# EAGLE schematic 8Enc (EAGLE 6.5.0)

## Sheet 1 of 2
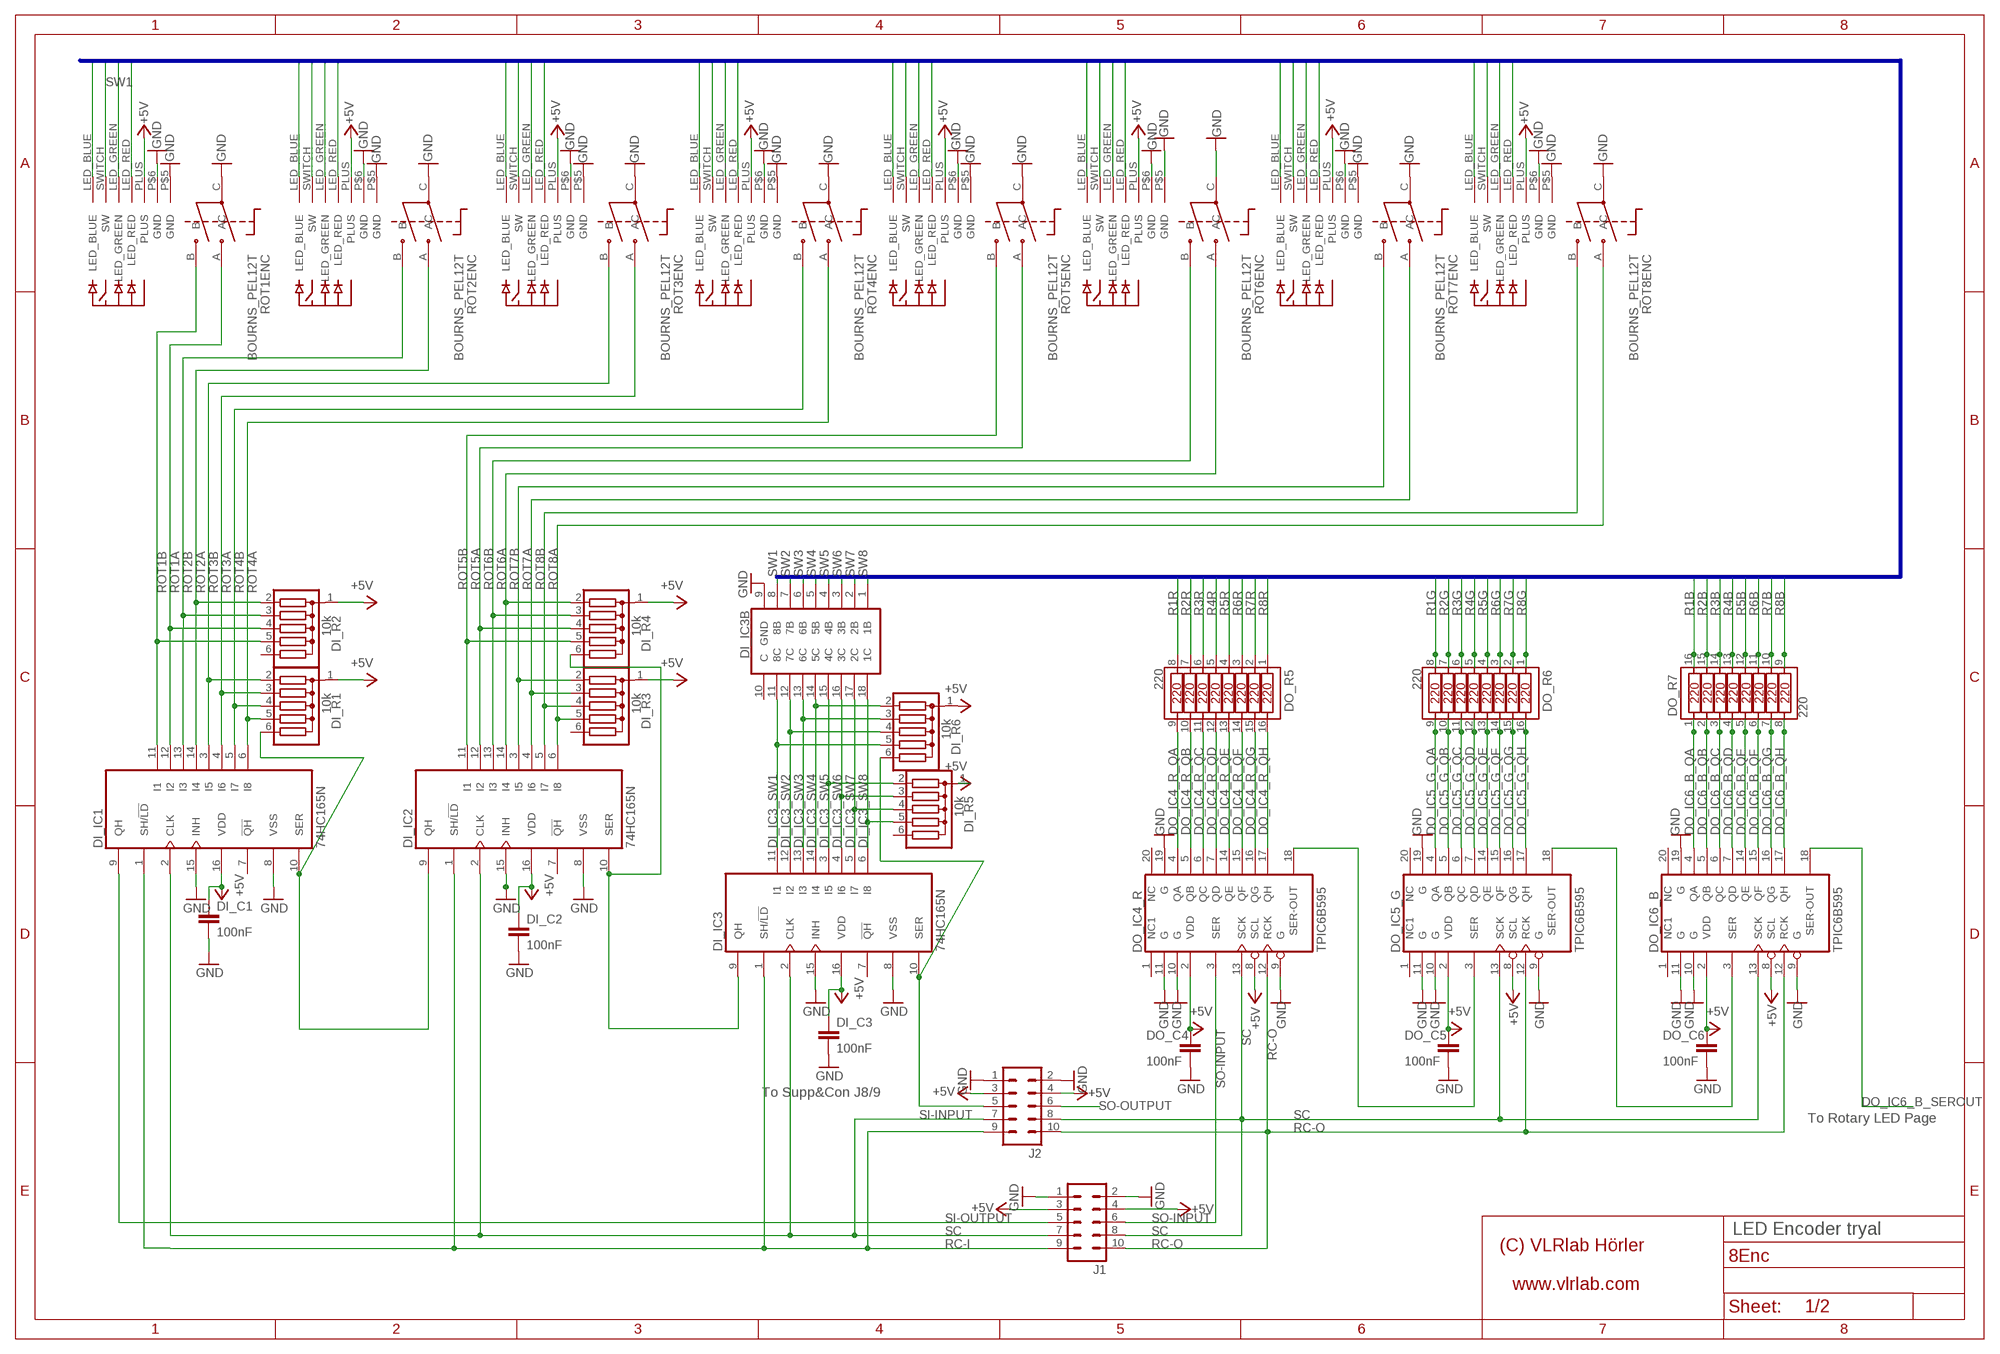
[diagram p0: schematic, sheet 1]

### Parts
DI_C1  100nF  C-EU025-024X044  [C025-024X044]
DI_C2  100nF  C-EU025-024X044  [C025-024X044]
DI_C3  100nF  C-EU025-024X044  [C025-024X044]
DI_IC1  74HC165N  74HC165NSO16D  [SO16D]
DI_IC2  74HC165N  74HC165NSO16D  [SO16D]
DI_IC3  74HC165N  74HC165NSO16D  [SO16D]
DI_IC3B  ULN2803SO18W  [SO18W]
DI_R1  10k  4306R  [SIL6]
DI_R2  10k  4306R  [SIL6]
DI_R3  10k  4306R  [SIL6]
DI_R4  10k  4306R  [SIL6]
DI_R5  10k  4306R  [SIL6]
DI_R6  10k  4306R  [SIL6]
DO_C4  100nF  C-EU025-024X044  [C025-024X044]
DO_C5  100nF  C-EU025-024X044  [C025-024X044]
DO_C6  100nF  C-EU025-024X044  [C025-024X044]
DO_IC4_R  TPIC6B595  TPIC6B595SO20W  [SO20W]
DO_IC5_G  TPIC6B595  TPIC6B595SO20W  [SO20W]
DO_IC6_B  TPIC6B595  TPIC6B595SO20W  [SO20W]
DO_R5  220  4816P-1SOIC16W  [SOIC16W]
DO_R6  220  4816P-1SOIC16W  [SOIC16W]
DO_R7  220  4816P-1SOIC16W  [SOIC16W]
J1  ML10  [ML10]
J2  ML10  [ML10]
ROT1  BOURNS_PEL12T  BOURNS_PEL12T_11-LED-RING  [PEL12T_11-LED-RING]
ROT2  BOURNS_PEL12T  BOURNS_PEL12T_11-LED-RING  [PEL12T_11-LED-RING]
ROT3  BOURNS_PEL12T  BOURNS_PEL12T_11-LED-RING  [PEL12T_11-LED-RING]
ROT4  BOURNS_PEL12T  BOURNS_PEL12T_11-LED-RING  [PEL12T_11-LED-RING]
ROT5  BOURNS_PEL12T  BOURNS_PEL12T_11-LED-RING  [PEL12T_11-LED-RING]
ROT6  BOURNS_PEL12T  BOURNS_PEL12T_11-LED-RING  [PEL12T_11-LED-RING]
ROT7  BOURNS_PEL12T  BOURNS_PEL12T_11-LED-RING  [PEL12T_11-LED-RING]
ROT8  BOURNS_PEL12T  BOURNS_PEL12T_11-LED-RING  [PEL12T_11-LED-RING]

### Nets
+5V [VDD]: DI_C1.1 DI_C2.1 DI_C3.1 DI_IC1.16(VDD) DI_IC2.16(VDD) DI_IC3.16(VDD) DI_R1.1 DI_R2.1 DI_R3.1 DI_R4.1 DI_R5.1 DI_R6.1 DO_C4.1 DO_C5.1 DO_C6.1 DO_IC4_R.2(VDD) DO_IC4_R.8(SCL) DO_IC5_G.2(VDD) DO_IC5_G.8(SCL) DO_IC6_B.2(VDD) DO_IC6_B.8(SCL) J1.3 J1.4 J2.3 J2.4 ROT1.PLUS(ENC:PLUS) ROT2.PLUS(ENC:PLUS) ROT3.PLUS(ENC:PLUS) ROT4.PLUS(ENC:PLUS) ROT5.PLUS(ENC:PLUS) ROT6.PLUS(ENC:PLUS) ROT7.PLUS(ENC:PLUS) ROT8.PLUS(ENC:PLUS) ; also sheet 2
DI_IC3_SW1: DI_IC3.11(I1) DI_IC3B.11(8C) DI_R6.5
DI_IC3_SW2: DI_IC3.12(I2) DI_IC3B.12(7C) DI_R6.4
DI_IC3_SW3: DI_IC3.13(I3) DI_IC3B.13(6C) DI_R6.3
DI_IC3_SW4: DI_IC3.14(I4) DI_IC3B.14(5C) DI_R6.2
DI_IC3_SW5: DI_IC3.3(I5) DI_IC3B.15(4C) DI_R5.2
DI_IC3_SW6: DI_IC3.4(I6) DI_IC3B.16(3C) DI_R5.3
DI_IC3_SW7: DI_IC3.5(I7) DI_IC3B.17(2C) DI_R5.4
DI_IC3_SW8: DI_IC3.6(I8) DI_IC3B.18(1C) DI_R5.5
DI_IC4_SER_OUT2: DI_IC1.10(SER) DI_IC2.9(QH) DI_R1.6
DI_IC5_SER_OUT2: DI_IC2.10(SER) DI_IC3.9(QH) DI_R4.6
DO_IC4_R_QA: DO_IC4_R.4(QA) DO_R5.9
DO_IC4_R_QB: DO_IC4_R.5(QB) DO_R5.10
DO_IC4_R_QC: DO_IC4_R.6(QC) DO_R5.11
DO_IC4_R_QD: DO_IC4_R.7(QD) DO_R5.12
DO_IC4_R_QE: DO_IC4_R.14(QE) DO_R5.13
DO_IC4_R_QF: DO_IC4_R.15(QF) DO_R5.14
DO_IC4_R_QG: DO_IC4_R.16(QG) DO_R5.15
DO_IC4_R_QH: DO_IC4_R.17(QH) DO_R5.16
DO_IC4_R_SEROUT: DO_IC4_R.18(SER-OUT) DO_IC5_G.3(SER)
DO_IC5_G_QA: DO_IC5_G.4(QA) DO_R6.9
DO_IC5_G_QB: DO_IC5_G.5(QB) DO_R6.10
DO_IC5_G_QC: DO_IC5_G.6(QC) DO_R6.11
DO_IC5_G_QD: DO_IC5_G.7(QD) DO_R6.12
DO_IC5_G_QE: DO_IC5_G.14(QE) DO_R6.13
DO_IC5_G_QF: DO_IC5_G.15(QF) DO_R6.14
DO_IC5_G_QG: DO_IC5_G.16(QG) DO_R6.15
DO_IC5_G_QH: DO_IC5_G.17(QH) DO_R6.16
DO_IC5_G_SEROUT: DO_IC5_G.18(SER-OUT) DO_IC6_B.3(SER)
DO_IC6_B_QA: DO_IC6_B.4(QA) DO_R7.1
DO_IC6_B_QB: DO_IC6_B.5(QB) DO_R7.2
DO_IC6_B_QC: DO_IC6_B.6(QC) DO_R7.3
DO_IC6_B_QD: DO_IC6_B.7(QD) DO_R7.4
DO_IC6_B_QE: DO_IC6_B.14(QE) DO_R7.5
DO_IC6_B_QF: DO_IC6_B.15(QF) DO_R7.6
DO_IC6_B_QG: DO_IC6_B.16(QG) DO_R7.7
DO_IC6_B_QH: DO_IC6_B.17(QH) DO_R7.8
DO_IC6_B_SEROUT: DO_IC6_B.18(SER-OUT) ; also sheet 2
GND: DI_C1.2 DI_C2.2 DI_C3.2 DI_IC1.8(VSS) DI_IC1.15(INH) DI_IC2.8(VSS) DI_IC2.15(INH) DI_IC3.8(VSS) DI_IC3.15(INH) DI_IC3B.9(GND) DO_C4.2 DO_C5.2 DO_C6.2 DO_IC4_R.9(G) DO_IC4_R.10(G) DO_IC4_R.11(G) DO_IC4_R.19(G) DO_IC5_G.9(G) DO_IC5_G.10(G) DO_IC5_G.11(G) DO_IC5_G.19(G) DO_IC6_B.9(G) DO_IC6_B.10(G) DO_IC6_B.11(G) DO_IC6_B.19(G) J1.1 J1.2 J2.1 J2.2 ROT1.C(ENC:C) ROT1.P$5(ENC:GND) ROT1.P$6(ENC:GND) ROT2.C(ENC:C) ROT2.P$5(ENC:GND) ROT2.P$6(ENC:GND) ROT3.C(ENC:C) ROT3.P$5(ENC:GND) ROT3.P$6(ENC:GND) ROT4.C(ENC:C) ROT4.P$5(ENC:GND) ROT4.P$6(ENC:GND) ROT5.C(ENC:C) ROT5.P$5(ENC:GND) ROT5.P$6(ENC:GND) ROT6.C(ENC:C) ROT6.P$5(ENC:GND) ROT6.P$6(ENC:GND) ROT7.C(ENC:C) ROT7.P$5(ENC:GND) ROT7.P$6(ENC:GND) ROT8.C(ENC:C) ROT8.P$5(ENC:GND) ROT8.P$6(ENC:GND) ; also sheet 2
R1B: DO_R7.16 ROT1.LED_BLUE(ENC:LED_BLUE)
R1G: DO_R6.8 ROT1.LED_GREEN(ENC:LED_GREEN)
R1R: DO_R5.8 ROT1.LED_RED(ENC:LED_RED)
R2B: DO_R7.15 ROT2.LED_BLUE(ENC:LED_BLUE)
R2G: DO_R6.7 ROT2.LED_GREEN(ENC:LED_GREEN)
R2R: DO_R5.7 ROT2.LED_RED(ENC:LED_RED)
R3B: DO_R7.14 ROT3.LED_BLUE(ENC:LED_BLUE)
R3G: DO_R6.6 ROT3.LED_GREEN(ENC:LED_GREEN)
R3R: DO_R5.6 ROT3.LED_RED(ENC:LED_RED)
R4B: DO_R7.13 ROT4.LED_BLUE(ENC:LED_BLUE)
R4G: DO_R6.5 ROT4.LED_GREEN(ENC:LED_GREEN)
R4R: DO_R5.5 ROT4.LED_RED(ENC:LED_RED)
R5B: DO_R7.12 ROT5.LED_BLUE(ENC:LED_BLUE)
R5G: DO_R6.4 ROT5.LED_GREEN(ENC:LED_GREEN)
R5R: DO_R5.4 ROT5.LED_RED(ENC:LED_RED)
R6B: DO_R7.11 ROT6.LED_BLUE(ENC:LED_BLUE)
R6G: DO_R6.3 ROT6.LED_GREEN(ENC:LED_GREEN)
R6R: DO_R5.3 ROT6.LED_RED(ENC:LED_RED)
R7B: DO_R7.10 ROT7.LED_BLUE(ENC:LED_BLUE)
R7G: DO_R6.2 ROT7.LED_GREEN(ENC:LED_GREEN)
R7R: DO_R5.2 ROT7.LED_RED(ENC:LED_RED)
R8B: DO_R7.9 ROT8.LED_BLUE(ENC:LED_BLUE)
R8G: DO_R6.1 ROT8.LED_GREEN(ENC:LED_GREEN)
R8R: DO_R5.1 ROT8.LED_RED(ENC:LED_RED)
RC-I: DI_IC1.1(SH/!LD) DI_IC2.1(SH/!LD) DI_IC3.1(SH/!LD) J1.9 J2.9
RC-O: DO_IC4_R.12(RCK) DO_IC5_G.12(RCK) DO_IC6_B.12(RCK) J1.10 J2.10 ; also sheet 2
ROT1A: DI_IC1.12(I2) DI_R2.4 ROT1.A(ENC:A)
ROT1B: DI_IC1.11(I1) DI_R2.5 ROT1.B(ENC:B)
ROT2A: DI_IC1.14(I4) DI_R2.2 ROT2.A(ENC:A)
ROT2B: DI_IC1.13(I3) DI_R2.3 ROT2.B(ENC:B)
ROT3A: DI_IC1.4(I6) DI_R1.3 ROT3.A(ENC:A)
ROT3B: DI_IC1.3(I5) DI_R1.2 ROT3.B(ENC:B)
ROT4A: DI_IC1.6(I8) DI_R1.5 ROT4.A(ENC:A)
ROT4B: DI_IC1.5(I7) DI_R1.4 ROT4.B(ENC:B)
ROT5A: DI_IC2.12(I2) DI_R4.4 ROT5.A(ENC:A)
ROT5B: DI_IC2.11(I1) DI_R4.5 ROT5.B(ENC:B)
ROT6A: DI_IC2.14(I4) DI_R4.2 ROT6.A(ENC:A)
ROT6B: DI_IC2.13(I3) DI_R4.3 ROT6.B(ENC:B)
ROT7A: DI_IC2.4(I6) DI_R3.3 ROT7.A(ENC:A)
ROT7B: DI_IC2.3(I5) DI_R3.2 ROT7.B(ENC:B)
ROT8A: DI_IC2.6(I8) DI_R3.5 ROT8.A(ENC:A)
ROT8B: DI_IC2.5(I7) DI_R3.4 ROT8.B(ENC:B)
SC: DI_IC1.2(CLK) DI_IC2.2(CLK) DI_IC3.2(CLK) DO_IC4_R.13(SCK) DO_IC5_G.13(SCK) DO_IC6_B.13(SCK) J1.7 J1.8 J2.7 J2.8 ; also sheet 2
SI-INPUT: DI_IC3.10(SER) DI_R6.6 J2.5
SI-OUTPUT: DI_IC1.9(QH) J1.5
SO-INPUT: DO_IC4_R.3(SER) J1.6
SO-OUTPUT: J2.6 ; also sheet 2
SW1: DI_IC3B.8(8B) ROT1.SWITCH(ENC:SW)
SW2: DI_IC3B.7(7B) ROT2.SWITCH(ENC:SW)
SW3: DI_IC3B.6(6B) ROT3.SWITCH(ENC:SW)
SW4: DI_IC3B.5(5B) ROT4.SWITCH(ENC:SW)
SW5: DI_IC3B.4(4B) ROT5.SWITCH(ENC:SW)
SW6: DI_IC3B.3(3B) ROT6.SWITCH(ENC:SW)
SW7: DI_IC3B.2(2B) ROT7.SWITCH(ENC:SW)
SW8: DI_IC3B.1(1B) ROT8.SWITCH(ENC:SW)
Unconnected: DI_IC1.7(!QH) DI_IC2.7(!QH) DI_IC3.7(!QH) DI_IC3B.10(C) DI_R2.6 DI_R3.6 DI_R5.6 DO_IC4_R.1(NC1) DO_IC4_R.20(NC) DO_IC5_G.1(NC1) DO_IC5_G.20(NC) DO_IC6_B.1(NC1) DO_IC6_B.20(NC)

### Buses
SW1,SW2,SW3,SW4,SW5,SW6,SW7,SW8,R1B,R2B,R3B,R4B,R5B,R6B,R7B,R8B,R1G,R2G,R3G,R4G,R5G,R6G,R7G,R8G,R1R,R2R,R3R,R4R,R5R,R6R,R7R,R8R

### Notes on the sheet
- To Supp&Con J8/9
- To Rotary LED Page
- LED Encoder tryal

## Sheet 2 of 2
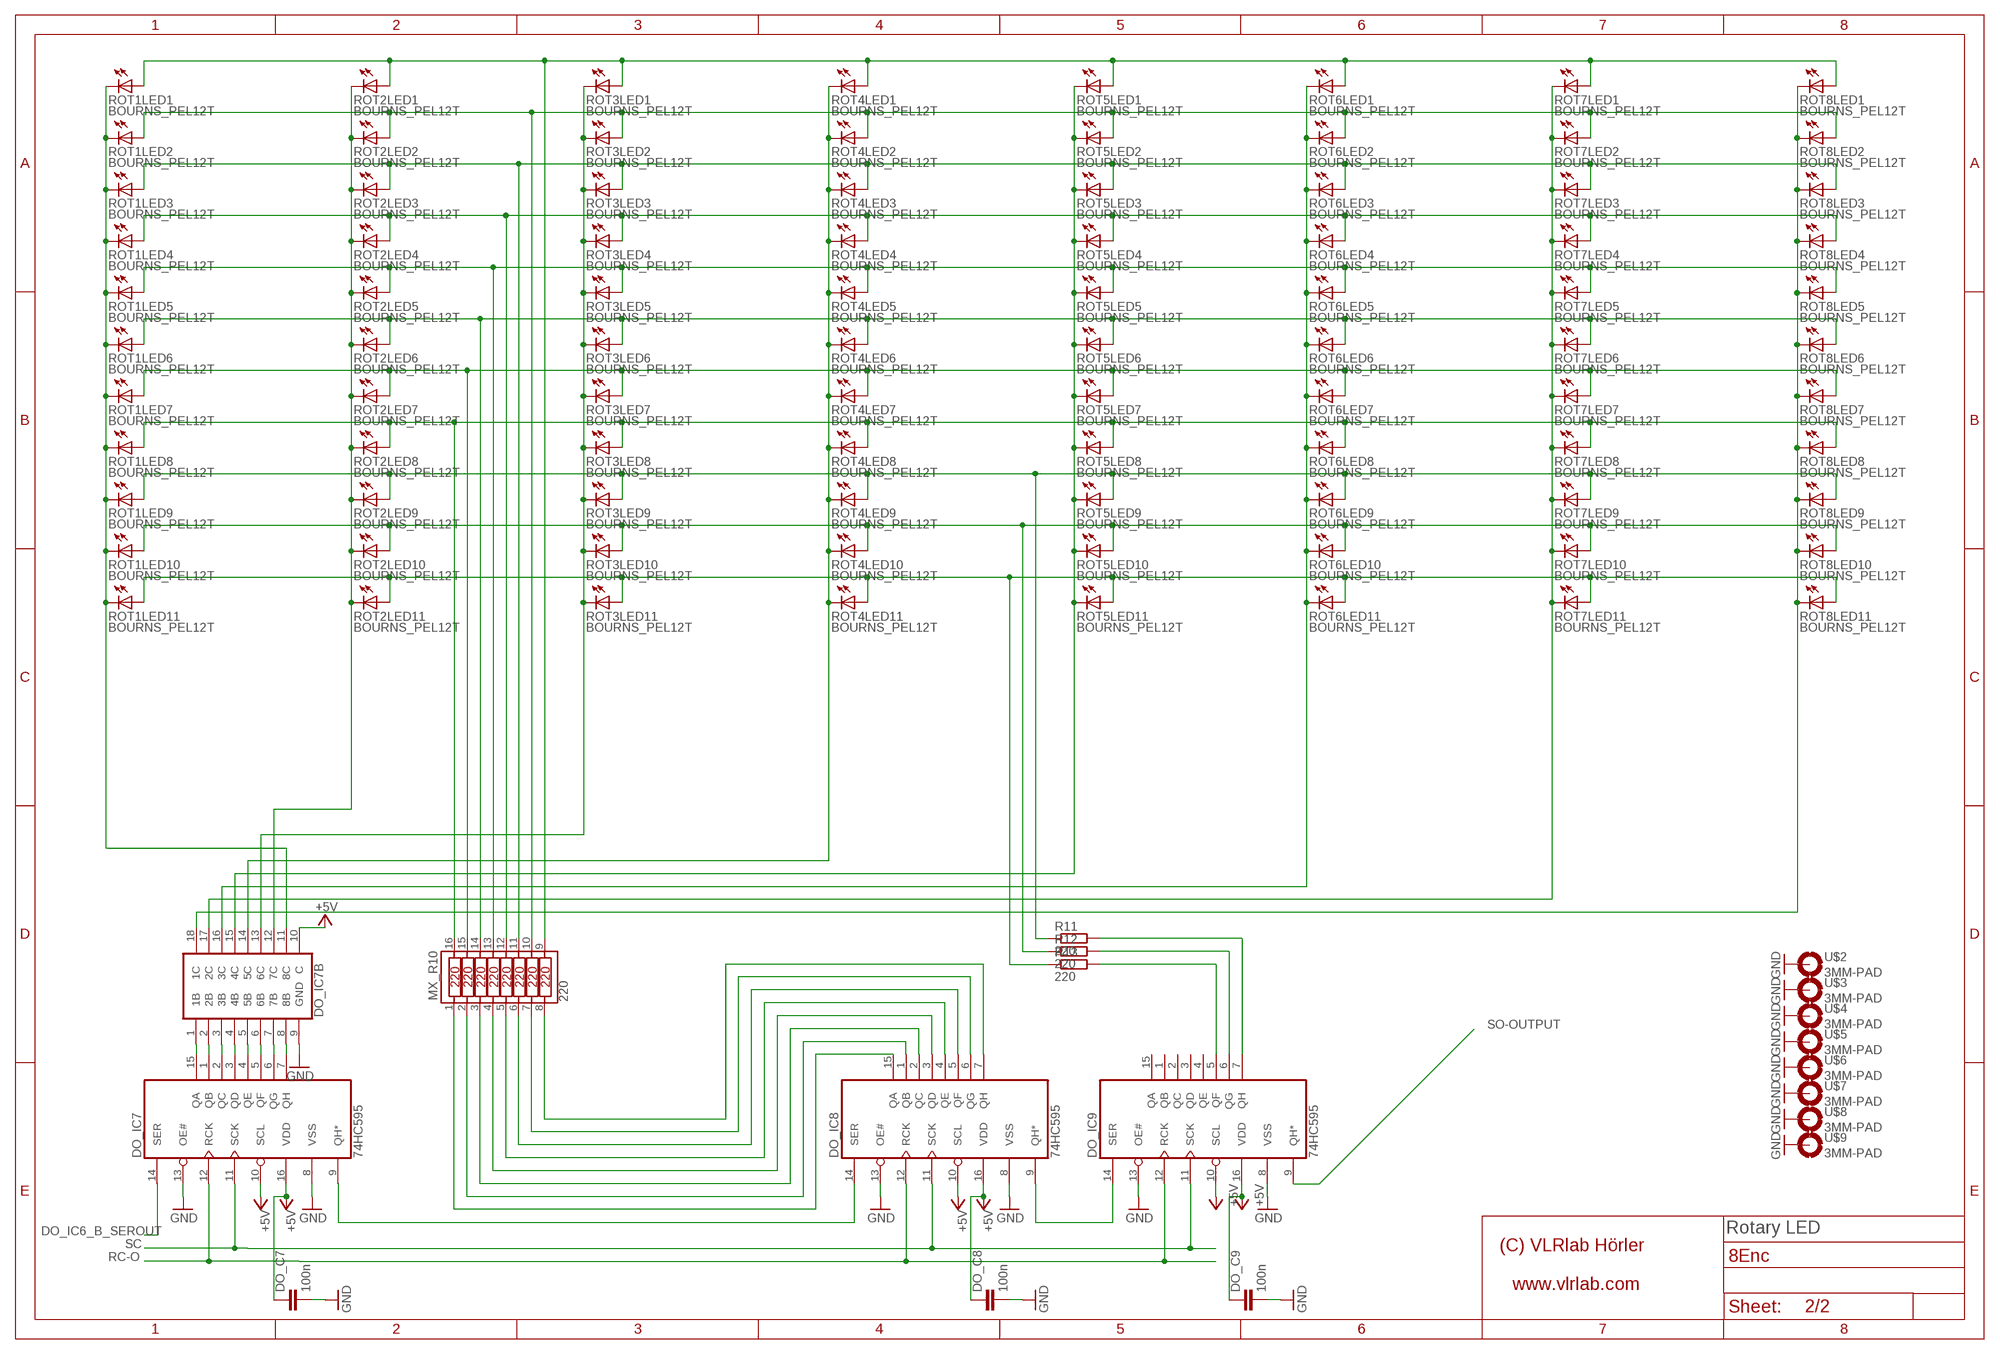
[diagram p1: schematic, sheet 2]

### Parts
DO_C7  100n  C-EU025-024X044  [C025-024X044]
DO_C8  100n  C-EU025-024X044  [C025-024X044]
DO_C9  100n  C-EU025-024X044  [C025-024X044]
DO_IC7  74HC595  74HC595SO16D  [SO16D]
DO_IC7B  ULN2803SO18W  [SO18W]
DO_IC8  74HC595  74HC595SO16D  [SO16D]
DO_IC9  74HC595  74HC595SO16D  [SO16D]
MX_R10  220  4816P-1SOIC16W  [SOIC16W]
R11  220  R-EU_0204/7  [0204/7]
R12  220  R-EU_0204/7  [0204/7]
R13  220  R-EU_0204/7  [0204/7]
U$2  3MM-PAD  [3MM-PAD]
U$3  3MM-PAD  [3MM-PAD]
U$4  3MM-PAD  [3MM-PAD]
U$5  3MM-PAD  [3MM-PAD]
U$6  3MM-PAD  [3MM-PAD]
U$7  3MM-PAD  [3MM-PAD]
U$8  3MM-PAD  [3MM-PAD]
U$9  3MM-PAD  [3MM-PAD]

### Nets
+5V [VDD]: DO_C7.1 DO_C8.1 DO_C9.1 DO_IC7.10(SCL) DO_IC7.16(VDD) DO_IC7B.10(C) DO_IC8.10(SCL) DO_IC8.16(VDD) DO_IC9.10(SCL) DO_IC9.16(VDD) ; also sheet 1
DO_IC6_B_SEROUT: DO_IC7.14(SER) ; also sheet 1
DO_IC7_QA: DO_IC7.15(QA) DO_IC7B.1(1B)
DO_IC7_QB: DO_IC7.1(QB) DO_IC7B.2(2B)
DO_IC7_QC: DO_IC7.2(QC) DO_IC7B.3(3B)
DO_IC7_QD: DO_IC7.3(QD) DO_IC7B.4(4B)
DO_IC7_QE: DO_IC7.4(QE) DO_IC7B.5(5B)
DO_IC7_QF: DO_IC7.5(QF) DO_IC7B.6(6B)
DO_IC7_QG: DO_IC7.6(QG) DO_IC7B.7(7B)
DO_IC7_QH: DO_IC7.7(QH) DO_IC7B.8(8B)
DO_IC7_SEROUT: DO_IC7.9(QH*) DO_IC8.14(SER)
DO_IC8_QA: DO_IC8.15(QA) MX_R10.1
DO_IC8_QB: DO_IC8.1(QB) MX_R10.2
DO_IC8_QC: DO_IC8.2(QC) MX_R10.3
DO_IC8_QD: DO_IC8.3(QD) MX_R10.4
DO_IC8_QE: DO_IC8.4(QE) MX_R10.5
DO_IC8_QF: DO_IC8.5(QF) MX_R10.6
DO_IC8_QG: DO_IC8.6(QG) MX_R10.7
DO_IC8_QH: DO_IC8.7(QH) MX_R10.8
DO_IC8_SEROUT: DO_IC8.9(QH*) DO_IC9.14(SER)
DO_IC9_QF: DO_IC9.5(QF) R13.2
DO_IC9_QG: DO_IC9.6(QG) R12.2
DO_IC9_QH: DO_IC9.7(QH) R11.2
GND: DO_C7.2 DO_C8.2 DO_C9.2 DO_IC7.8(VSS) DO_IC7.13(OE#) DO_IC7B.9(GND) DO_IC8.8(VSS) DO_IC8.13(OE#) DO_IC9.8(VSS) DO_IC9.13(OE#) U$2.B3(MOUNT) U$3.B3(MOUNT) U$4.B3(MOUNT) U$5.B3(MOUNT) U$6.B3(MOUNT) U$7.B3(MOUNT) U$8.B3(MOUNT) U$9.B3(MOUNT) ; also sheet 1
MATRIXLED1: MX_R10.9 ROT1.A1(LED1:A) ROT2.A1(LED1:A) ROT3.A1(LED1:A) ROT4.A1(LED1:A) ROT5.A1(LED1:A) ROT6.A1(LED1:A) ROT7.A1(LED1:A) ROT8.A1(LED1:A)
MATRIXLED2: MX_R10.10 ROT1.A2(LED2:A) ROT2.A2(LED2:A) ROT3.A2(LED2:A) ROT4.A2(LED2:A) ROT5.A2(LED2:A) ROT6.A2(LED2:A) ROT7.A2(LED2:A) ROT8.A2(LED2:A)
MATRIXLED3: MX_R10.11 ROT1.A3(LED3:A) ROT2.A3(LED3:A) ROT3.A3(LED3:A) ROT4.A3(LED3:A) ROT5.A3(LED3:A) ROT6.A3(LED3:A) ROT7.A3(LED3:A) ROT8.A3(LED3:A)
MATRIXLED4: MX_R10.12 ROT1.A4(LED4:A) ROT2.A4(LED4:A) ROT3.A4(LED4:A) ROT4.A4(LED4:A) ROT5.A4(LED4:A) ROT6.A4(LED4:A) ROT7.A4(LED4:A) ROT8.A4(LED4:A)
MATRIXLED5: MX_R10.13 ROT1.A5(LED5:A) ROT2.A5(LED5:A) ROT3.A5(LED5:A) ROT4.A5(LED5:A) ROT5.A5(LED5:A) ROT6.A5(LED5:A) ROT7.A5(LED5:A) ROT8.A5(LED5:A)
MATRIXLED6: MX_R10.14 ROT1.A6(LED6:A) ROT2.A6(LED6:A) ROT3.A6(LED6:A) ROT4.A6(LED6:A) ROT5.A6(LED6:A) ROT6.A6(LED6:A) ROT7.A6(LED6:A) ROT8.A6(LED6:A)
MATRIXLED7: MX_R10.15 ROT1.A7(LED7:A) ROT2.A7(LED7:A) ROT3.A7(LED7:A) ROT4.A7(LED7:A) ROT5.A7(LED7:A) ROT6.A7(LED7:A) ROT7.A7(LED7:A) ROT8.A7(LED7:A)
MATRIXLED8: MX_R10.16 ROT1.A8(LED8:A) ROT2.A8(LED8:A) ROT3.A8(LED8:A) ROT4.A8(LED8:A) ROT5.A8(LED8:A) ROT6.A8(LED8:A) ROT7.A8(LED8:A) ROT8.A8(LED8:A)
MATRIXLED9: R11.1 ROT1.A9(LED9:A) ROT2.A9(LED9:A) ROT3.A9(LED9:A) ROT4.A9(LED9:A) ROT5.A9(LED9:A) ROT6.A9(LED9:A) ROT7.A9(LED9:A) ROT8.A9(LED9:A)
MATRIXLED10: R12.1 ROT1.A10(LED10:A) ROT2.A10(LED10:A) ROT3.A10(LED10:A) ROT4.A10(LED10:A) ROT5.A10(LED10:A) ROT6.A10(LED10:A) ROT7.A10(LED10:A) ROT8.A10(LED10:A)
MATRIXLED11: R13.1 ROT1.A12(LED11:A) ROT2.A12(LED11:A) ROT3.A12(LED11:A) ROT4.A12(LED11:A) ROT5.A12(LED11:A) ROT6.A12(LED11:A) ROT7.A12(LED11:A) ROT8.A12(LED11:A)
MATRIXROT1: DO_IC7B.11(8C) ROT1.K1(LED1:C) ROT1.K2(LED2:C) ROT1.K3(LED3:C) ROT1.K4(LED4:C) ROT1.K5(LED5:C) ROT1.K6(LED6:C) ROT1.K7(LED7:C) ROT1.K8(LED8:C) ROT1.K9(LED9:C) ROT1.K10(LED10:C) ROT1.K12(LED11:C)
MATRIXROT2: DO_IC7B.12(7C) ROT2.K1(LED1:C) ROT2.K2(LED2:C) ROT2.K3(LED3:C) ROT2.K4(LED4:C) ROT2.K5(LED5:C) ROT2.K6(LED6:C) ROT2.K7(LED7:C) ROT2.K8(LED8:C) ROT2.K9(LED9:C) ROT2.K10(LED10:C) ROT2.K12(LED11:C)
MATRIXROT3: DO_IC7B.13(6C) ROT3.K1(LED1:C) ROT3.K2(LED2:C) ROT3.K3(LED3:C) ROT3.K4(LED4:C) ROT3.K5(LED5:C) ROT3.K6(LED6:C) ROT3.K7(LED7:C) ROT3.K8(LED8:C) ROT3.K9(LED9:C) ROT3.K10(LED10:C) ROT3.K12(LED11:C)
MATRIXROT4: DO_IC7B.14(5C) ROT4.K1(LED1:C) ROT4.K2(LED2:C) ROT4.K3(LED3:C) ROT4.K4(LED4:C) ROT4.K5(LED5:C) ROT4.K6(LED6:C) ROT4.K7(LED7:C) ROT4.K8(LED8:C) ROT4.K9(LED9:C) ROT4.K10(LED10:C) ROT4.K12(LED11:C)
MATRIXROT5: DO_IC7B.15(4C) ROT5.K1(LED1:C) ROT5.K2(LED2:C) ROT5.K3(LED3:C) ROT5.K4(LED4:C) ROT5.K5(LED5:C) ROT5.K6(LED6:C) ROT5.K7(LED7:C) ROT5.K8(LED8:C) ROT5.K9(LED9:C) ROT5.K10(LED10:C) ROT5.K12(LED11:C)
MATRIXROT6: DO_IC7B.16(3C) ROT6.K1(LED1:C) ROT6.K2(LED2:C) ROT6.K3(LED3:C) ROT6.K4(LED4:C) ROT6.K5(LED5:C) ROT6.K6(LED6:C) ROT6.K7(LED7:C) ROT6.K8(LED8:C) ROT6.K9(LED9:C) ROT6.K10(LED10:C) ROT6.K12(LED11:C)
MATRIXROT7: DO_IC7B.17(2C) ROT7.K1(LED1:C) ROT7.K2(LED2:C) ROT7.K3(LED3:C) ROT7.K4(LED4:C) ROT7.K5(LED5:C) ROT7.K6(LED6:C) ROT7.K7(LED7:C) ROT7.K8(LED8:C) ROT7.K9(LED9:C) ROT7.K10(LED10:C) ROT7.K12(LED11:C)
MATRIXROT8: DO_IC7B.18(1C) ROT8.K1(LED1:C) ROT8.K2(LED2:C) ROT8.K3(LED3:C) ROT8.K4(LED4:C) ROT8.K5(LED5:C) ROT8.K6(LED6:C) ROT8.K7(LED7:C) ROT8.K8(LED8:C) ROT8.K9(LED9:C) ROT8.K10(LED10:C) ROT8.K12(LED11:C)
RC-O: DO_IC7.12(RCK) DO_IC8.12(RCK) DO_IC9.12(RCK) ; also sheet 1
SC: DO_IC7.11(SCK) DO_IC8.11(SCK) DO_IC9.11(SCK) ; also sheet 1
SO-OUTPUT: DO_IC9.9(QH*) ; also sheet 1
Unconnected: DO_IC9.1(QB) DO_IC9.2(QC) DO_IC9.3(QD) DO_IC9.4(QE) DO_IC9.15(QA)

### Notes on the sheet
- Rotary LED

## Library data of the parts
DI_C1-DI_C3 DO_C4-DO_C9 = rcl:C-EU: CAPACITOR, European symbol
DI_IC1-DI_IC3 = 595-541-165-uln2803:74HC165N
DI_IC3B DO_IC7B = 595-541-165-uln2803:ULN2803
DI_R1-DI_R6 = Bourns Resistor Array:4306R
DO_IC4_R DO_IC5_G DO_IC6_B = TPIC6B595:TPIC6B595
DO_IC7-DO_IC9 = 595-541-165-uln2803:74HC595
DO_R5-DO_R7 MX_R10 = Bourns Resistor Array:4816P-1
J1 J2 = con-ml:ML10: HARTING; OC_FARNELL: unknown; OC_NEWARK: unknown
R11-R13 = rcl:R-EU_: RESISTOR, European symbol
ROT1-ROT8 = Bourns Encoder:BOURNS_PEL12T_11-LED-RING
U$2-U$9 = holes_Ivan:3MM-PAD

## Net classes
0 default: width 0.254 mm, drill 0.33 mm, clearance 0.254 mm
1 VDD: width 0.61 mm, drill 0.33 mm, clearance 0.254 mm to class 0, clearance 0.254 mm